# Altium schematic sheet RGB_LED.SchDoc: MoonPilot - RGB LED
size A3; DrawnBy: Máni Magnússon; Revision: A
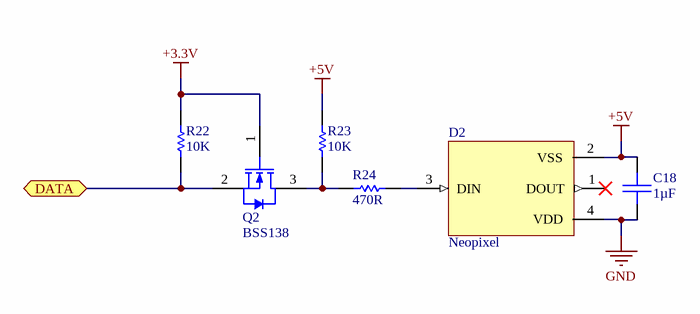
[diagram p0: RGB_LED.SchDoc]

## Parts
C18  1µF  [0603_CAP]
D2  Neopixel  [2659]
Q2  BSS138  [INTR-SOT-23-3_V]
R22  10K  [0603_RES]
R23  10K  [0603_RES]
R24  470R  [0603_RES]

## Ports
DATA (bidir)

## Nets
+3.3V: Q2.1(G) R22.1
+5V: C18.1 D2.2(VSS) R23.1
GND: C18.2 D2.4(VDD)
DATA: Q2.2(S) R22.2 ; port DATA
NetD2_3: D2.3(DIN) R24.2
NetQ2_3: Q2.3(D) R23.2 R24.1

Not connected (* = marked no-connect by the designer): D2 1(DOUT)*

## Notes on the sheet
- Sheet title:
- Revision:
- Drawn by:
- Date:
- File:

## Library data of the parts
C18 = Capacitor
D2 = Neopixel: Adafruit Neopixel SMD 3535 / Adafruit part no. 2659 / Digikey part no. 1528-1542-ND; MF: Adafruit Industries; MP: 2659; SnapEDA_Link: https://www.snapeda.com/parts/2659/Adafruit%20Industries%20LLC/view-part/548522/?ref=snap; Package: TQFP-32 Adafruit Industries; Digi-Key_Purchase_URL: https://www.digikey.com/product-detail/en/pololu-corporation/2659/2183-2659-ND/10451102?utm_source=snapeda&utm_medium=aggregator&utm_campaign=symbol; Digi-Key_Part_Number: 2183-2659-ND; Value: *
Q2 = IRLML2502TRPBF: N-Channel HEXFET(R) Power MOSFET, 20 V VDS, +/- 12 V VGS, 4.2 A, 3-Pin SOT23, RoHS, Tape and Reel; Manufacturer: International Rectifier; Drain-to-Source Voltage [Vdss]: 20V; Drain-Source On Resistance-Max: 0.045O; Qg Gate Charge: 8nC; Rated Power Dissipation: 1.25W; Package Reference: SOT-23-3; Manufacturer URL: http://internationalrectifier.com/; Package Description: 3-Pin Small Outline Transistor, Body 2.92 x 1.3 mm, Pitch 0.95 mm; Datasheet Version: Apr-14; Channel Type: N-Channel; Datasheet URL: https://datasheet.ciiva.com/6383/irlml2502pbf-6383216.pdf
R22-R24 = Resistor